# EAGLE schematic Experiment2 (EAGLE 8.3.2)
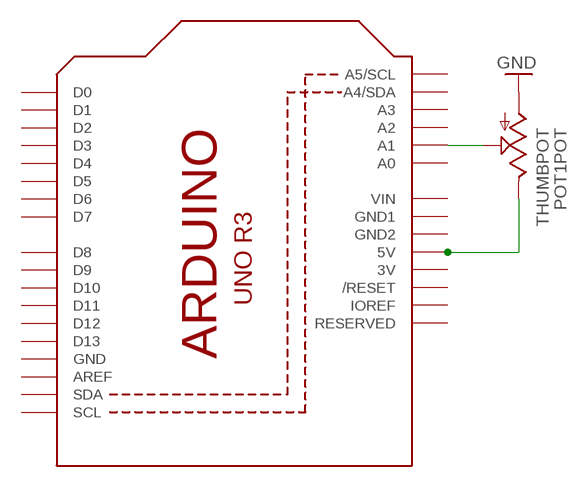
[diagram p0: schematic, sheet 1]

## Parts
POT1  THUMBPOT  [THUMBWHEEL]
U1  ARDUINOR3-DIMENSION  [ARDUINOR3]

## Nets
GND: POT1.1(POT:A)
N$3: POT1.2(POT:S) U1.A1
N$4: POT1.3(POT:E) U1.5V
Unconnected: POT1.SW1(SW:S) POT1.SW2(SW:P) U1.A0 U1.A2 U1.A3 U1.A4(A4/SDA) U1.A5(A5/SCL) U1.AREF U1.D0 U1.D1 U1.D2 U1.D3 U1.D4 U1.D5 U1.D6 U1.D7 U1.D8 U1.D9 U1.D10 U1.D11 U1.D12 U1.D13 U1.IOREF U1.RESERVED U1.RESET(/RESET) U1.SCL U1.SDA

## Power pins joined to a net without a drawn wire
3V: U1.3V
GND: U1.GND
GND1: U1.GND1
GND2: U1.GND2
VIN: U1.VIN

## Library data of the parts
POT1 = adafruit:THUMBPOT: Thumbwheel pot with switch Available in horizontal (Alpha RV121SF) or vertical (Xicon 311-1701)
U1 = adafruit:ARDUINOR3: This is a new object for the new Arduino R3 - with extra pins that you may want to use (such as IOref, and duplicated A4/A5